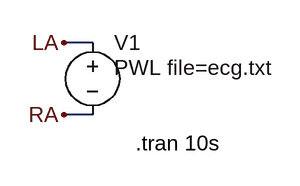
[diagram p0: schematic test.asc]
test.asc, the LTspice schematic file:
Version 4
SHEET 1 880 680
WIRE -160 80 -192 80
WIRE -160 160 -192 160
FLAG -192 80 LA
FLAG -192 160 RA
SYMBOL voltage -160 64 R0
WINDOW 123 24 44 Left 2
WINDOW 39 0 0 Left 0
WINDOW 3 24 44 Left 2
SYMATTR Value2 PWL file=ecg.txt
SYMATTR Value ""
SYMATTR InstName V1
TEXT -112 192 Left 2 !.tran 10s

The netlist it stands for:
* test.asc
V1 LA RA PWL file=ecg.txt
.tran 10s
.backanno
.end